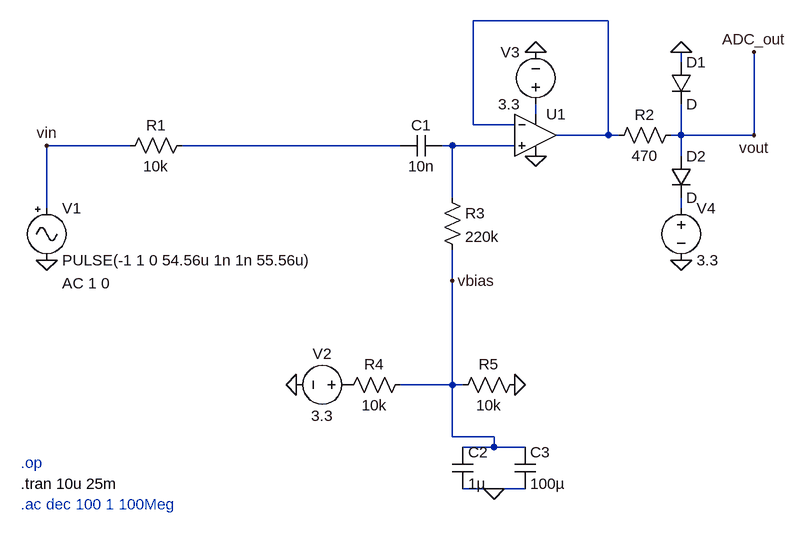
[diagram p0: schematic FRONT_END_DSO_SIMULATION.asc]
FRONT_END_DSO_SIMULATION.asc, the LTspice schematic file:
Version 4.1
SHEET 1 2136 680
WIRE 1104 -272 896 -272
WIRE 1216 -208 1216 -224
WIRE 992 -128 992 -144
WIRE 896 -112 896 -272
WIRE 960 -112 896 -112
WIRE 1104 -96 1104 -272
WIRE 1104 -96 1024 -96
WIRE 1120 -96 1104 -96
WIRE 1216 -96 1216 -144
WIRE 1216 -96 1200 -96
WIRE 1328 -96 1328 -224
WIRE 1328 -96 1216 -96
WIRE 368 -80 240 -80
WIRE 784 -80 448 -80
WIRE 864 -80 848 -80
WIRE 960 -80 864 -80
WIRE 1216 -64 1216 -96
WIRE 864 0 864 -80
WIRE 240 16 240 -80
WIRE 1216 16 1216 0
WIRE 864 128 864 80
WIRE 864 288 864 128
WIRE 864 288 784 288
WIRE 880 288 864 288
WIRE 864 368 864 288
WIRE 928 368 864 368
WIRE 928 384 928 368
WIRE 928 384 880 384
WIRE 976 384 928 384
WIRE 928 448 880 448
WIRE 976 448 928 448
FLAG 240 96 0
FLAG 960 288 0
FLAG 624 288 0
FLAG 864 128 vbias
FLAG 1328 -96 vout
FLAG 240 -80 vin
FLAG 928 448 0
FLAG 992 -224 0
FLAG 992 -64 0
FLAG 1216 96 0
FLAG 1216 -224 0
FLAG 1328 -224 ADC_out
SYMBOL Misc\\signal 240 0 R0
WINDOW 123 24 132 Left 2
WINDOW 39 0 0 Left 0
SYMATTR Value2 AC 1 0
SYMATTR InstName V1
SYMATTR Value PULSE(-1 1 0 54.56u 1n 1n 55.56u)
SYMBOL res 464 -96 R90
WINDOW 0 0 56 VBottom 2
WINDOW 3 32 56 VTop 2
SYMATTR InstName R1
SYMATTR Value 10k
SYMBOL cap 848 -96 R90
WINDOW 0 0 32 VBottom 2
WINDOW 3 32 32 VTop 2
SYMATTR InstName C1
SYMATTR Value 10n
SYMBOL res 848 -16 R0
SYMATTR InstName R3
SYMATTR Value 220k
SYMBOL res 800 272 R90
WINDOW 0 0 56 VBottom 2
WINDOW 3 32 56 VTop 2
SYMATTR InstName R4
SYMATTR Value 10k
SYMBOL res 976 272 R90
WINDOW 0 0 56 VBottom 2
WINDOW 3 32 56 VTop 2
SYMATTR InstName R5
SYMATTR Value 10k
SYMBOL voltage 720 288 R90
WINDOW 0 -32 56 VBottom 2
WINDOW 3 32 56 VTop 2
WINDOW 123 0 0 Left 0
WINDOW 39 0 0 Left 0
SYMATTR InstName V2
SYMATTR Value 3.3
SYMBOL cap 864 384 R0
SYMATTR InstName C2
SYMATTR Value 1µ
SYMBOL cap 960 384 R0
SYMATTR InstName C3
SYMATTR Value 100µ
SYMBOL voltage 992 -128 R180
WINDOW 0 24 96 Left 2
WINDOW 3 24 16 Left 2
WINDOW 123 0 0 Left 0
WINDOW 39 0 0 Left 0
SYMATTR InstName V3
SYMATTR Value 3.3
SYMBOL OpAmps\\UniversalOpAmp2 992 -96 R0
SYMATTR InstName U1
SYMBOL diode 1200 -208 R0
SYMATTR InstName D1
SYMBOL diode 1200 -64 R0
SYMATTR InstName D2
SYMBOL voltage 1216 0 R0
WINDOW 123 0 0 Left 0
WINDOW 39 0 0 Left 0
SYMATTR InstName V4
SYMATTR Value 3.3
SYMBOL res 1216 -112 R90
WINDOW 0 0 56 VBottom 2
WINDOW 3 32 56 VTop 2
SYMATTR InstName R2
SYMATTR Value 470
TEXT 200 408 Left 2 ;.op
TEXT 200 440 Left 2 !.tran 10u 25m
TEXT 200 472 Left 2 ;.ac dec 100 1 100Meg

The netlist it stands for:
* FRONT_END_DSO_SIMULATION.asc
V1 vin 0 PULSE(-1 1 0 54.56u 1n 1n 55.56u) AC 1 0
R1 N003 vin 10k
C1 N004 N003 10n
R3 N004 vbias 220k
R4 vbias P001 10k
R5 0 vbias 10k
V2 P001 0 3.3
C2 vbias 0 1µ
C3 vbias 0 100µ
V3 N002 0 3.3
X§U1 N004 N001 N002 0 N001 level2 Avol=1Meg GBW=10Meg Slew=10Meg Ilimit=25m Rail=0 Vos=0 En=0 Enk=0 In=0 Ink=0 Rin=500Meg  ; pins In+ In- V+ V- OUT
D1 0 ADC_out D
D2 ADC_out N005 D
V4 N005 0 3.3
R2 ADC_out N001 470
.model D D
.lib standard.dio
* .op
.tran 10u 25m
* .ac dec 100 1 100Meg
.lib UniversalOpAmp2.lib
.backanno
.end